# EAGLE schematic utility_v2_for_ad835 (EAGLE 8.7.1)

## Sheet 1 of 3
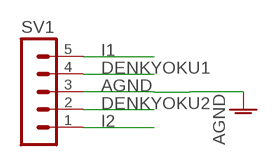
[diagram p0: schematic, sheet 1]

### Parts
SV1  MA05-1  [MA05-1]

### Nets
AGND: SV1.3
DENKYOKU1: SV1.4
DENKYOKU2: SV1.2
I1: SV1.5
I2: SV1.1

## Sheet 2 of 3
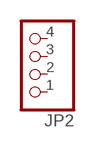
[diagram p1: schematic, sheet 2]

### Parts
JP2  PINHD-1X4  [1X04]
Unconnected: JP2.1 JP2.2 JP2.3 JP2.4

## Sheet 3 of 3
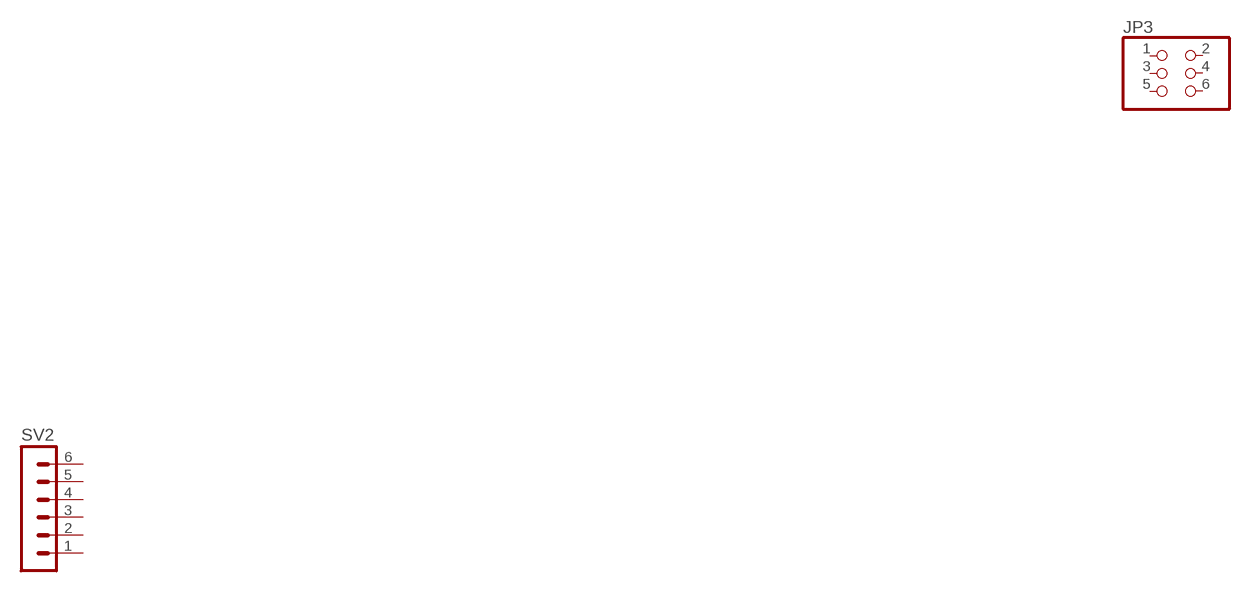
[diagram p2: schematic, sheet 3]

### Parts
JP3  PINHD-2X3  [2X03]
SV2  MA06-1  [MA06-1]
Unconnected: JP3.1 JP3.2 JP3.3 JP3.4 JP3.5 JP3.6 SV2.1 SV2.2 SV2.3 SV2.4 SV2.5 SV2.6

## Library data of the parts
JP2 = pinhead:PINHD-1X4: PIN HEADER
JP3 = pinhead:PINHD-2X3: PIN HEADER
SV1 = con-lstb:MA05-1: PIN HEADER; OC_FARNELL: unknown; OC_NEWARK: unknown
SV2 = con-lstb:MA06-1: PIN HEADER; OC_FARNELL: unknown; OC_NEWARK: unknown